# Altium project PCB_Optali.PrjPcb
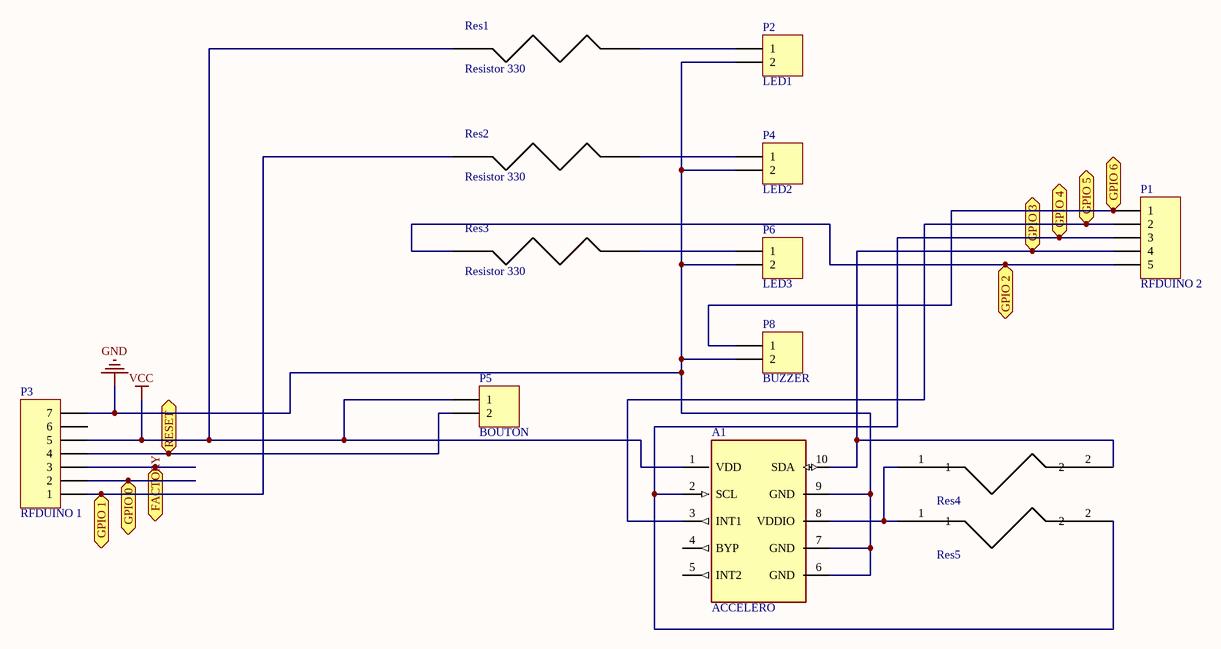
[diagram p0: Proto.SchDoc]
1 sheet, 13 parts. Net scope: flat (ports and power ports of the same name join across sheets).
Board file: Proto.PcbDoc

## Sheet Proto.SchDoc
size A4

### Parts
A1  ACCELERO  [SON40P200X100-10M]
P1  RFDUINO 2  [HDR1X5]
P2  LED1  [HDR1X2]
P3  RFDUINO 1  [HDR1X7]
P4  LED2  [HDR1X2]
P5  BOUTON  [HDR1X2]
P6  LED3  [HDR1X2]
P8  BUZZER  [HDR1X2]
Res1  Resistor 330  [RESC3116X06M]
Res2  Resistor 330  [RESC3116X06M]
Res3  Resistor 330  [RESC3116X06M]
Res4  res 1Kohms 0603 CMS  [RESC1608X06M]  (value not drawn)
Res5  res 1Kohms 0603 CMS  [RESC1608X06M]  (value not drawn)

### Ports
FACTORY, GPIO 0, GPIO 1, GPIO 2, GPIO 3, GPIO 4, GPIO 5, GPIO 6, RESET

### Nets
GND: A1.6(GND) A1.7(GND) A1.9(GND) P2.2 P3.7 P4.2 P6.2 P8.2
VCC: A1.1(VDD) P3.5 P5.1 Res1.1(I/O)
NetA1_2: A1.2(SCL) P1.3 Res5.2 ; port GPIO 4
NetA1_3: A1.3(INT1) P1.2 ; port GPIO 5
NetA1_8: A1.8(VDDIO) Res4.1 Res5.1
NetA1_10: A1.10(SDA) P1.4 Res4.2 ; port GPIO 3
NetP1_1: P1.1 P8.1 ; port GPIO 6
NetP1_5: P1.5 Res3.1(I/O) ; port GPIO 2
NetP2_1: P2.1 Res1.2(I/O)
NetP3_1: P3.1 Res2.1(I/O) ; port GPIO 1
NetP3_2: P3.2 ; port GPIO 0
NetP3_3: P3.3 ; port FACTORY
NetP3_4: P3.4 P5.2 ; port RESET
NetP4_1: P4.1 Res2.2(I/O)
NetP6_1: P6.1 Res3.2(I/O)

Not connected (* = marked no-connect by the designer): A1 4(BYP) 5(INT2); P3 6

### Library data of the parts
A1 = MMA8653FCR1: Accéléromètres 3-axis 2g/4g/8g 10 bit; Manufacturer: NXP / Freescale; Manufacturer Part Member: MMA8653FCR1; Published: 15/02/2017; Publisher: François Lefevre; Supplier: Mouser; Supplier Part Number: 841-MMA8653FCR1
P1 = Header 5: Header, 5-Pin; LatestRevisionDate: 17-Jul-2002; LatestRevisionNote: Re-released for DXP Platform.; Publisher: Altium Limited
P2 P4-P6 P8 = Header 2: Header, 2-Pin; LatestRevisionDate: 17-Jul-2002; LatestRevisionNote: Re-released for DXP Platform.; Publisher: Altium Limited
P3 = Header 7: Header, 7-Pin; LatestRevisionDate: 17-Jul-2002; LatestRevisionNote: Re-released for DXP Platform.; Publisher: Altium Limited
Res1-Res3 = CRCW1206330RFKEA: Résistance CMS 330 Ohms  250 mW  size 1206 taille 3.2x1.6 mm série CRCW; Manufacturer: Mouser; Power: 250 mW; Tolerance: 1%; Temp./coefficient: 100 ppm/K; Manufacturer Part Number: CRCW1206330RFKEA; Published: 16/02/2017; Publisher: François Lefevre; Supplier: Mouser; Supplier Part Number: 71-CRCW1206-330-E3; Resistance: 330 Ohms
Res4 Res5 = Res1000